# Altium schematic sheet Blok Diagram.SchDoc
size A3; Date: 01/12/2021; DrawnBy: Can Güveren; Engineer: Can; SheetNumber: 1; SheetTotal: 4; PageSize: A3
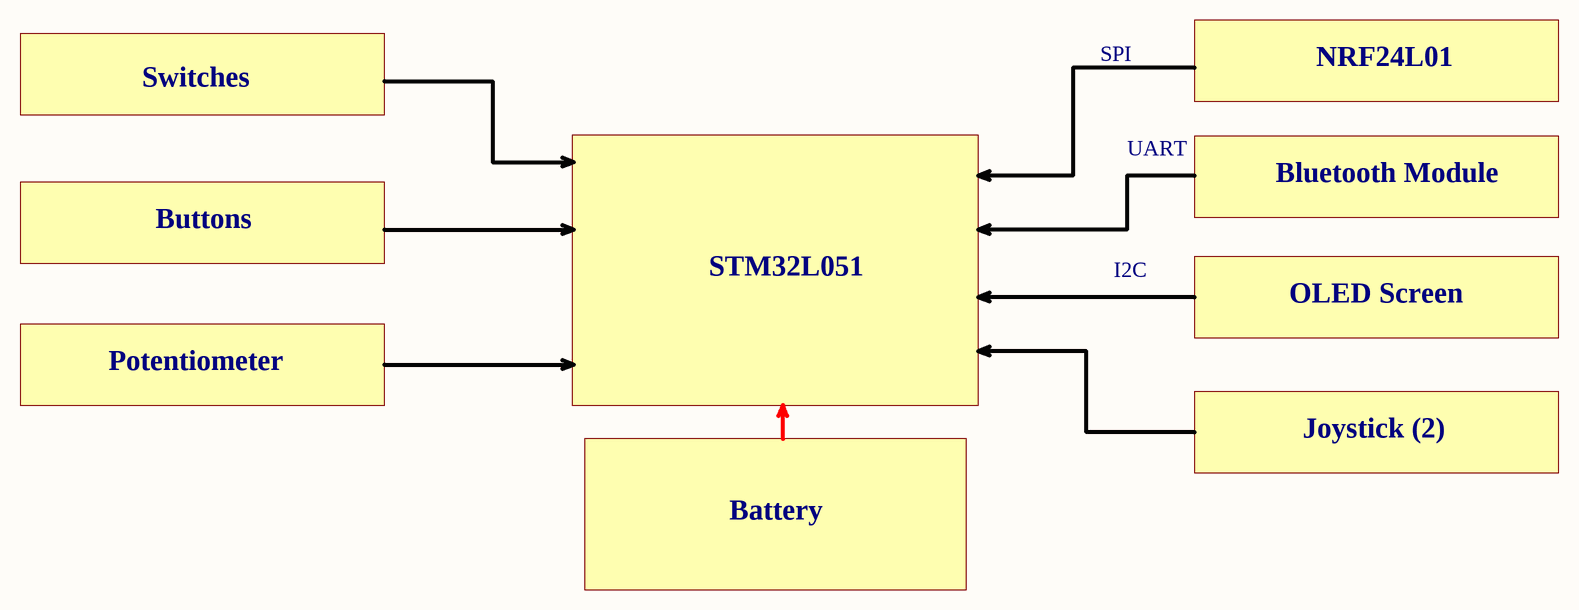
[diagram p0: Blok Diagram.SchDoc]

## Notes on the sheet
- Switches
- SPI
- NRF24L01
- UART
- Buttons
- Bluetooth Module
- STM32L051
- I2C
- OLED Screen
- Potentiometer
- Joystick (2)
- Battery
- Project Name
- Draw By
- Date
- Size
- Number